# EAGLE design PKD_shield (EAGLE 6.1)
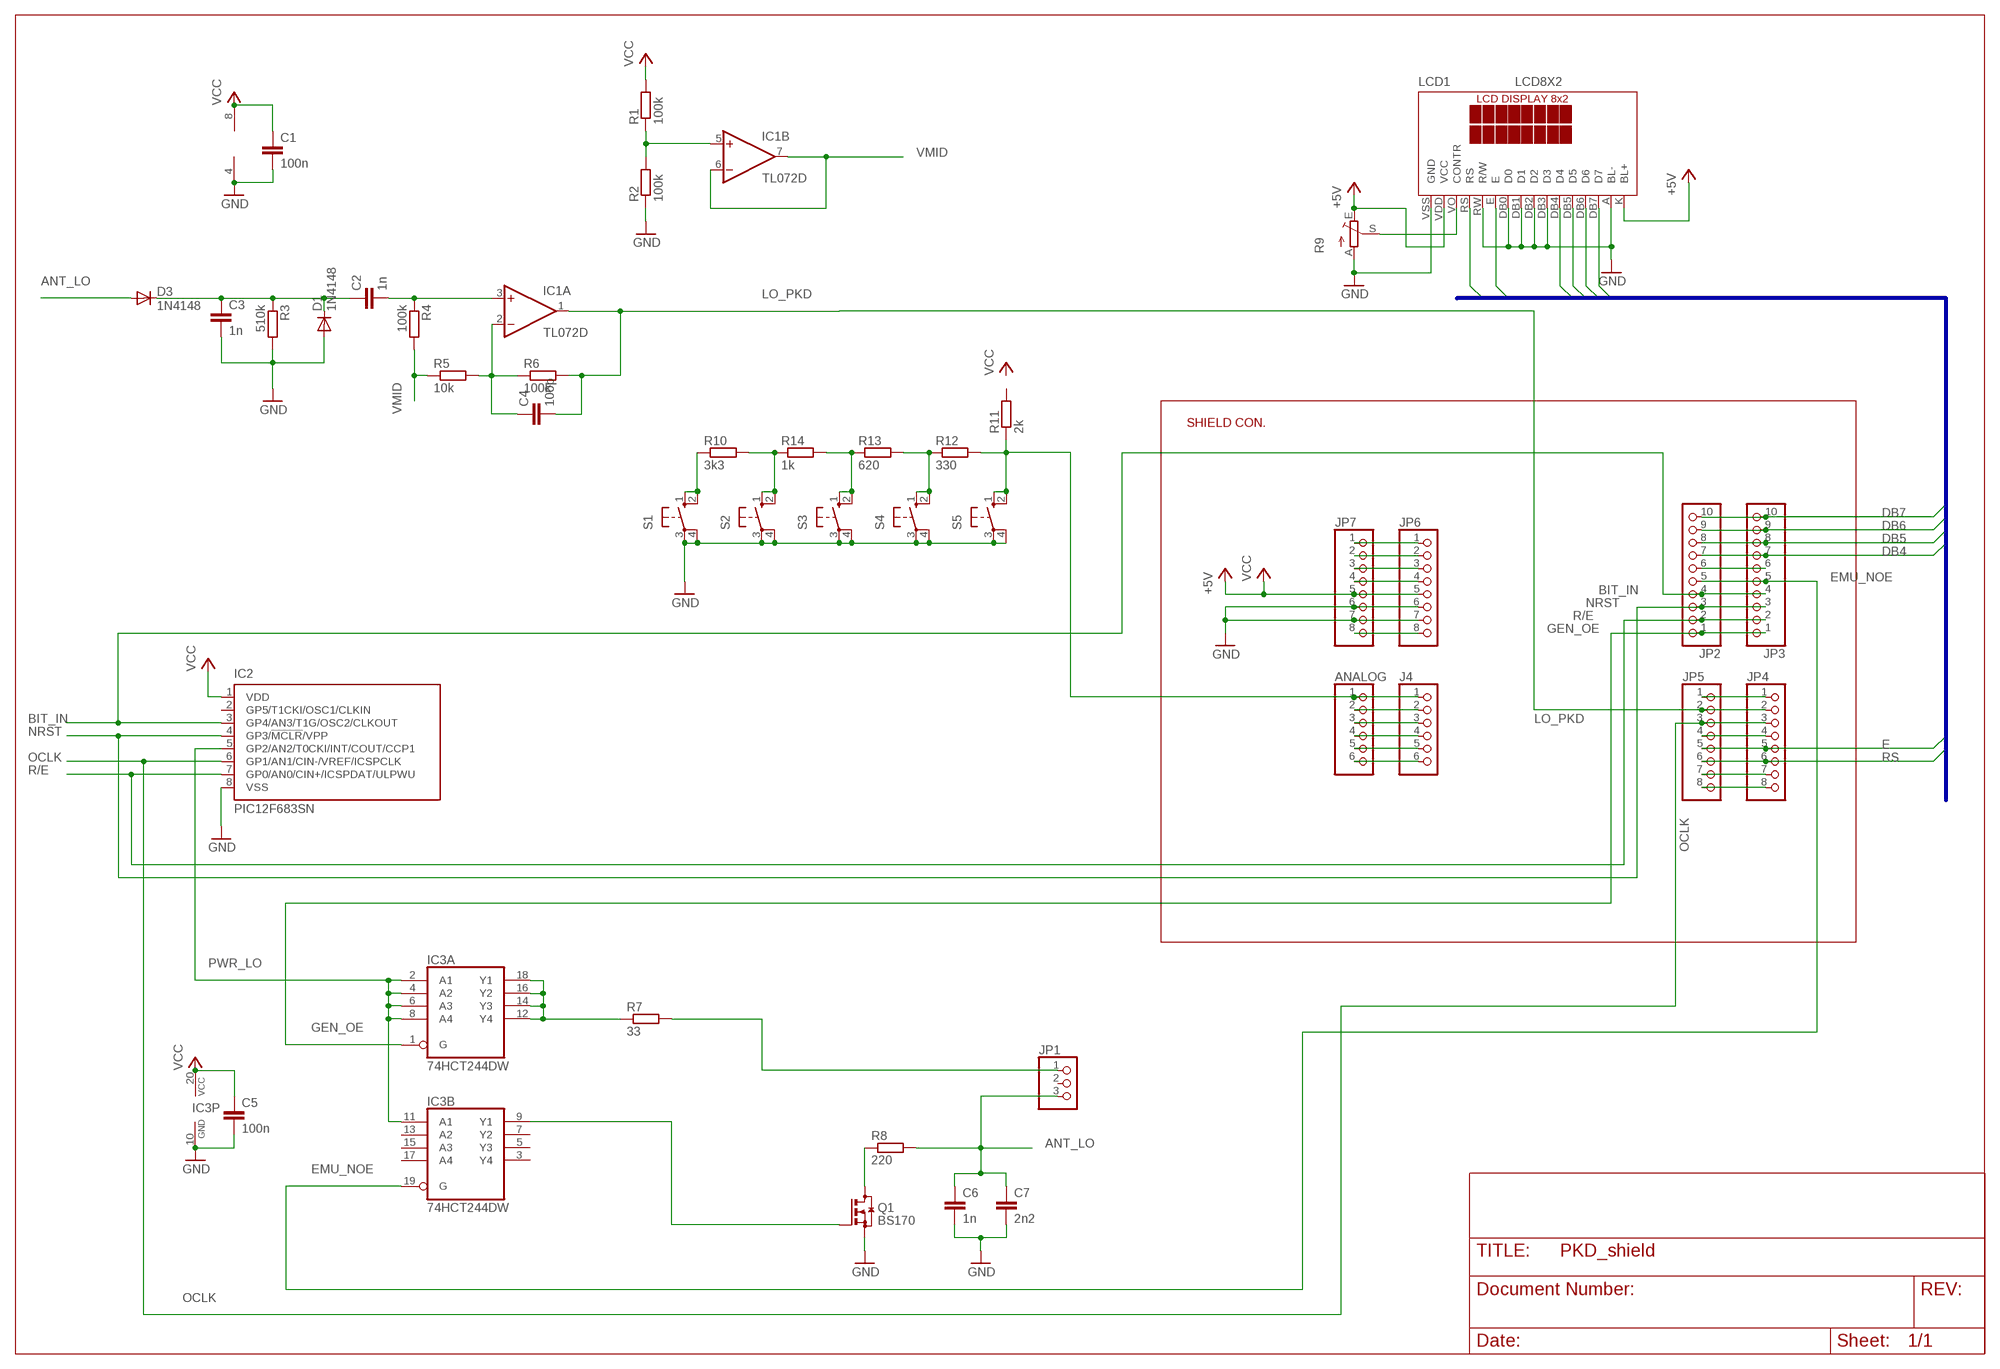
[diagram p0: schematic, sheet 1]

## Parts
ANALOG  PINHD-1X6  [1X06]
C1  100n  C-EUC1206  [C1206]
C2  1n  C-EUC1206  [C1206]
C3  1n  C-EUC1206  [C1206]
C4  100p  C-EUC1206  [C1206]
C5  100n  C-EUC1206  [C1206]
C6  1n  C-EUC1206  [C1206]
C7  2n2  C-EUC1206  [C1206]
D1  1N4148  DIODE-MELF-MLL41  [MELF-MLL41]
D3  1N4148  DIODE-MELF-MLL41  [MELF-MLL41]
IC1  TL072D  [SO08]
IC2  PIC12F683SN  [SO-08]
IC3  74HCT244DW  [SO20W]
J4  PINHD-1X6  [1X06]
JP1  PINHD-1X3  [1X03]
JP2  PINHD-1X10  [1X10]
JP3  PINHD-1X10  [1X10]
JP4  PINHD-1X8  [1X08]
JP5  PINHD-1X8  [1X08]
JP6  PINHD-1X8  [1X08]
JP7  PINHD-1X8  [1X08]
LCD1  LCD8X2  [LCD8X2]
Q1  BS170  [TO92]
R1  100k  R-EU_R1206  [R1206]
R2  100k  R-EU_R1206  [R1206]
R3  510k  R-EU_R1206  [R1206]
R4  100k  R-EU_R1206  [R1206]
R5  10k  R-EU_R1206  [R1206]
R6  100k  R-EU_R1206  [R1206]
R7  33  R-EU_R1206  [R1206]
R8  220  R-EU_R1206  [R1206]
R9  TRIM_EU-B25P  [B25P]
R10  3k3  R-EU_R1206  [R1206]
R11  2k  R-EU_R1206  [R1206]
R12  330  R-EU_R1206  [R1206]
R13  620  R-EU_R1206  [R1206]
R14  1k  R-EU_R1206  [R1206]
S1  10-XX  [B3F-10XX]
S2  10-XX  [B3F-10XX]
S3  10-XX  [B3F-10XX]
S4  10-XX  [B3F-10XX]
S5  10-XX  [B3F-10XX]

## Nets
+5V: LCD1.K(BL+) LCD1.VDD(VCC) R9.E
+9V: JP6.8 JP7.8
ANT_LO: C6.1 C7.1 D3.A JP1.3 R8.2
BIT_IN: IC2.3(GP4/AN3/T1G/OSC2/CLKOUT) JP2.4 JP3.4
DB4: JP2.7 JP3.7 LCD1.DB4(D4)
DB5: JP2.8 JP3.8 LCD1.DB5(D5)
DB6: JP2.9 JP3.9 LCD1.DB6(D6)
DB7: JP2.10 JP3.10 LCD1.DB7(D7)
E: JP4.5 JP5.5 LCD1.E
EMU_NOE: IC3.19(B:G) JP2.5 JP3.5
GEN_OE: IC3.1(A:G) JP2.1 JP3.1
GND: C1.2 C3.2 C5.2 C6.2 C7.2 D1.A IC1.4(P:V-) IC2.8(VSS) IC3.10(P:GND) JP6.7 JP7.7 LCD1.A(BL-) LCD1.DB0(D0) LCD1.DB1(D1) LCD1.DB2(D2) LCD1.DB3(D3) LCD1.RW(R/W) LCD1.VSS(GND) Q1.3(S) R2.1 R3.2 R9.A S1.3(P) S1.4(P1) S2.3(P) S2.4(P1) S3.3(P) S3.4(P1) S4.3(P) S4.4(P1) S5.3(P) S5.4(P1)
LO_PKD: JP4.2 JP5.2
LO_PKD_U: C4.2 IC1.1(A:OUT) R6.2
N$1: JP6.3 JP7.3
N$2: LCD1.VO(CONTR) R9.S
N$3: JP2.6 JP3.6
N$5: IC3.9(B:Y1) Q1.2(G)
N$6: R10.1 S1.1(S) S1.2(S1)
N$7: R10.2 R14.1 S2.1(S) S2.2(S1)
N$8: JP4.1 JP5.1
N$9: R13.1 R14.2 S3.1(S) S3.2(S1)
N$10: R12.1 R13.2 S4.1(S) S4.2(S1)
N$11: JP4.4 JP5.4
N$14: JP4.7 JP5.7
N$15: JP4.8 JP5.8
N$16: IC1.5(B:+IN) R1.1 R2.2
N$17: C2.1 C3.1 D1.C D3.C R3.1
N$18: ANALOG.1 J4.1 R11.1 R12.2 S5.1(S) S5.2(S1)
N$19: ANALOG.2 J4.2
N$20: ANALOG.3 J4.3
N$21: ANALOG.4 J4.4
N$22: ANALOG.5 J4.5
N$23: ANALOG.6 J4.6
N$25: JP6.6 JP7.6
N$26: C2.2 IC1.3(A:+IN) R4.1
N$27: C4.1 IC1.2(A:-IN) R5.2 R6.1
N$29: JP1.1 R7.2
N$30: IC3.12(A:Y4) IC3.14(A:Y3) IC3.16(A:Y2) IC3.18(A:Y1) R7.1
N$31: JP6.2 JP7.2
N$32: JP6.1 JP7.1
N$34: Q1.1(D) R8.1
N$223: JP6.4 JP7.4
NRST: IC2.4(GP3/!MCLR!/VPP) JP2.3 JP3.3
OCLK: IC2.6(GP1/AN1/CIN-/VREF/ICSPCLK) JP4.3 JP5.3
PWR_LO: IC2.5(GP2/AN2/T0CKI/INT/COUT/CCP1) IC3.2(A:A1) IC3.4(A:A2) IC3.6(A:A3) IC3.8(A:A4) IC3.11(B:A1)
R/E: IC2.7(GP0/AN0/CIN+/ICSPDAT/ULPWU) JP2.2 JP3.2
RS: JP4.6 JP5.6 LCD1.RS
VCC: C1.1 C5.1 IC1.8(P:V+) IC2.1(VDD) IC3.20(P:VCC) JP6.5 JP7.5 R1.2 ; supply symbol labelled +5V
VMID: IC1.6(B:-IN) IC1.7(B:OUT) R4.2 R5.1
Unconnected: IC2.2(GP5/T1CKI/OSC1/CLKIN) IC3.3(B:Y4) IC3.5(B:Y3) IC3.7(B:Y2) IC3.13(B:A2) IC3.15(B:A3) IC3.17(B:A4) JP1.2 R11.2

## Buses
RS,E,DB[4..7]

## Notes on the sheet
- SHIELD CON.

## Library data of the parts
ANALOG J4 = pinhead:PINHD-1X6: PIN HEADER
C1-C7 = rcl:C-EU: CAPACITOR, European symbol
D1 D3 = diode:DIODE-: DIODE
IC1 = linear:TL072: OP AMP
IC2 = microchip:PIC12F683: 8-Pin Flash-Based, 8-Bit CMOS Microcontrollers with nanoWatt Technology Source: http://ww1.microchip.com/downloads/en/DeviceDoc/41211D_.pdf; MF: MICROCHIP; MPN: PIC12F683-I/SN; OC_FARNELL: 9759042; OC_NEWARK: 61K3434
IC3 = 74xx-eu:74*244: Octal BUFFER and LINE DRIVER, 3-state
JP1 = pinhead:PINHD-1X3: PIN HEADER
JP2 JP3 = pinhead:PINHD-1X10: PIN HEADER
JP4-JP7 = pinhead:PINHD-1X8: PIN HEADER
LCD1 = various:LCD8X2
Q1 = various:BS170
R1-R8 R10-R14 = rcl:R-EU_: RESISTOR, European symbol
R9 = pot:TRIM_EU-: POTENTIOMETER
S1-S5 = switch-omron:10-XX: OMRON SWITCH; MPN: B3F-1000; OC_FARNELL: 176432; OC_NEWARK: 36M3542

## Net classes
0 default: width 0.4 mm, clearance 0.4 mm

## Board
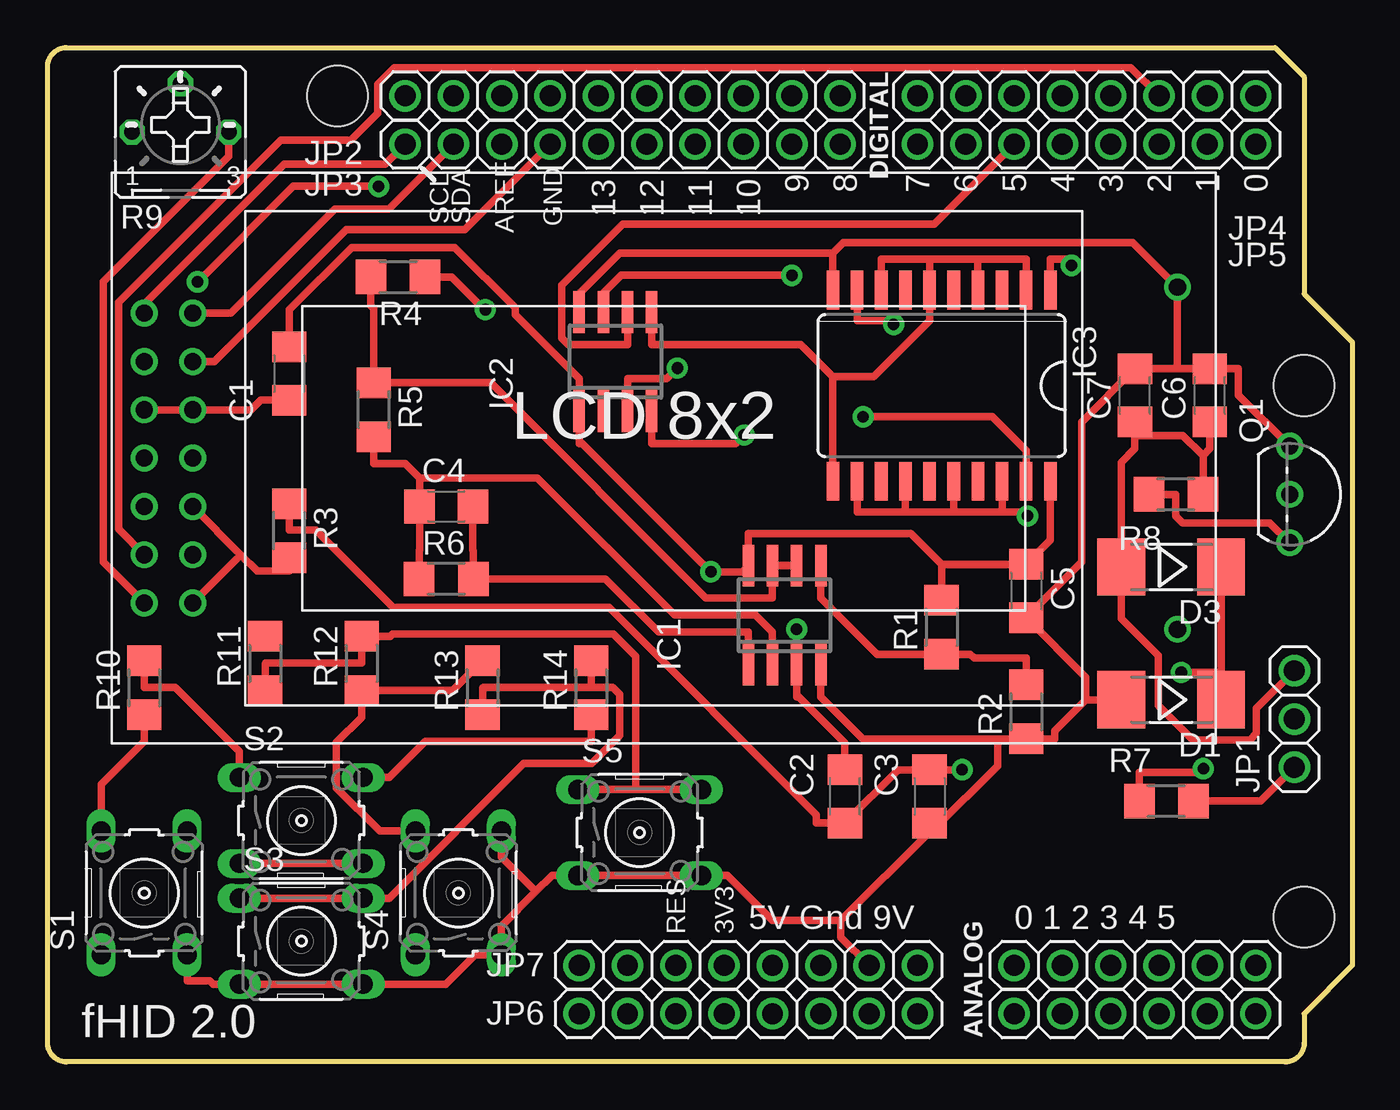
[diagram p1: board, top side]
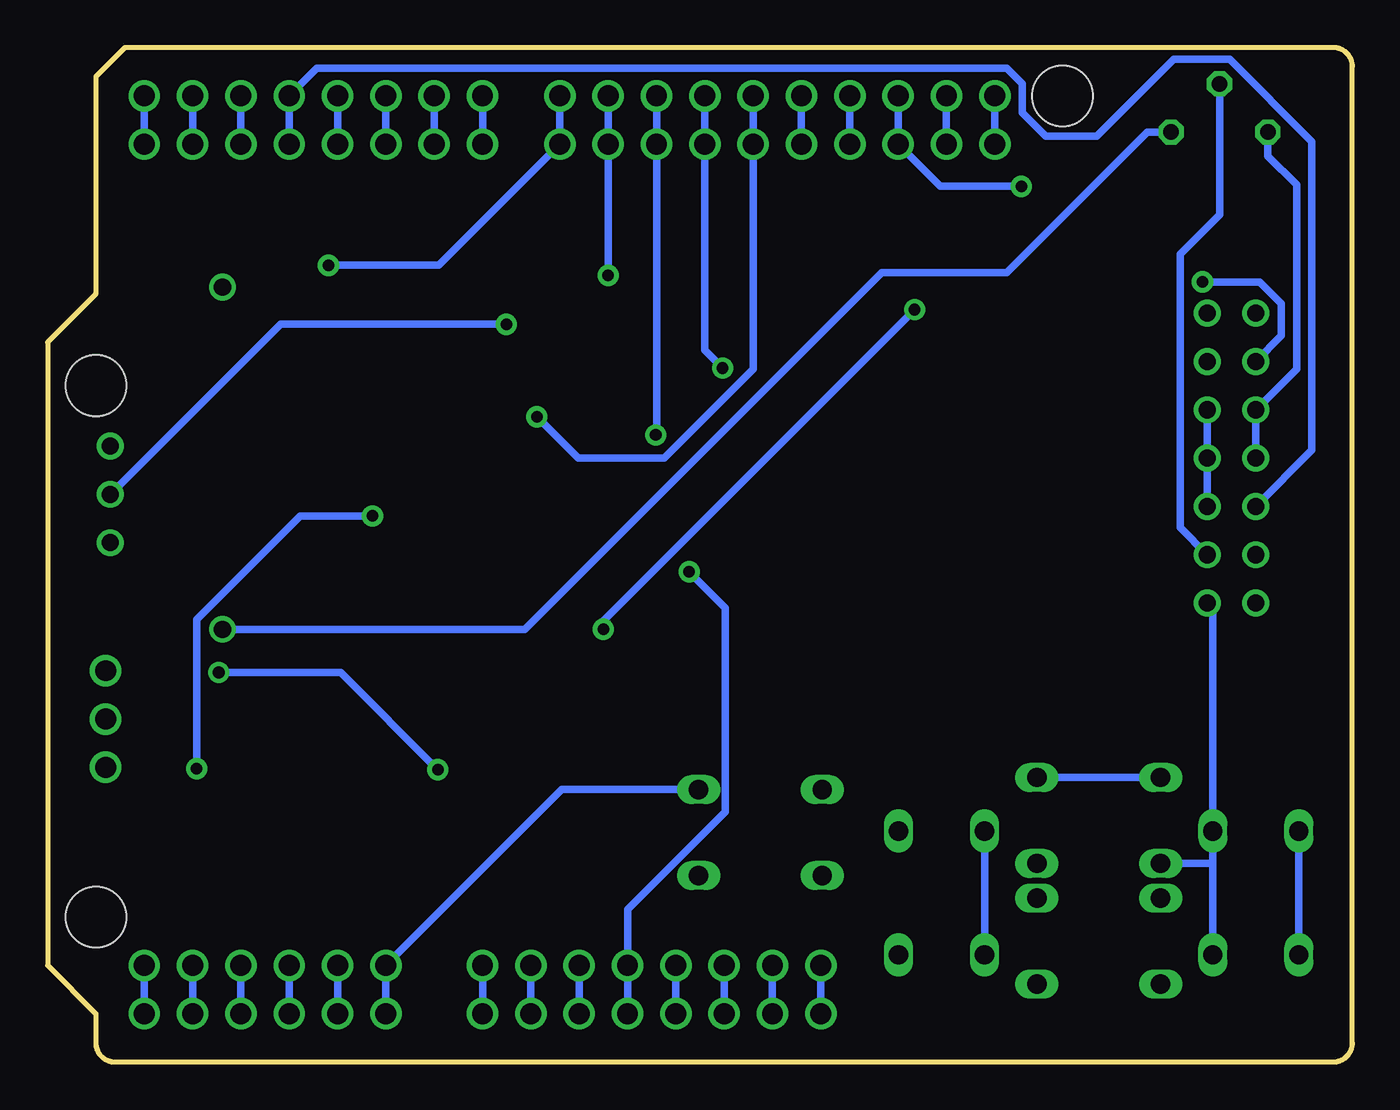
[diagram p2: board, bottom side, seen from below]

Size 68.58 x 53.34 mm. Coordinates in mm from the lower left corner, seen from the top.
Outline: 64.52,53.34 66.04,51.82 66.04,40.39 68.58,37.85 68.58,5.08 66.04,2.54 66.04,1 arc-90 65.04,0 1,0 arc-90 0,1 0,52.34 arc-90 1,53.34 64.52,53.34
Copper layers (1*16): Top 0.035mm / dielectric 1.5mm / Bottom 0.035mm
Design rules: minimum track width 10mil, minimum drill 24mil, track to track 10mil, track to pad 0.4032mm, pad to pad 10mil, via to via 10mil, smd to smd 8mil, copper to edge 40mil, drill to drill 10mil, minimum pad ring 10mil, minimum via ring 0.2532mm, stop-mask expansion 2mil, vias tented up to drill 0mil, thermal gap 10mil
Holes 3.2 mm at 15.24,50.8 66.04,7.62 66.04,35.56

### Footprints (pad centres in the part's own frame; a part is rotated, then mirrored left to right if it is on the bottom)
1X06 = drill 1.1: 1 -6.35,0; 2 -3.81,0; 3 -1.27,0; 4 1.27,0; 5 3.81,0; 6 6.35,0
C1206 = smd 1.6 x 1.8: 1 -1.4,0; 2 1.4,0
MELF-MLL41 = smd 2.5 x 3: A 2.625,0; C -2.625,0
SO08 = smd 0.6 x 2.2: 1 -1.905,-2.6; 2 -0.635,-2.6; 3 0.635,-2.6; 4 1.905,-2.6; 5 1.905,2.6; 6 0.635,2.6; 7 -0.635,2.6; 8 -1.905,2.6
SO-08 = smd 0.6 x 2.2: 1 -1.905,-2.6; 2 -0.635,-2.6; 3 0.635,-2.6; 4 1.905,-2.6; 5 1.905,2.6; 6 0.635,2.6; 7 -0.635,2.6; 8 -1.905,2.6
SO20W = smd 0.66 x 2.032: 1 -5.715,-5.029; 2 -4.445,-5.029; 3 -3.175,-5.029; 4 -1.905,-5.029; 5 -0.635,-5.029; 6 0.635,-5.029; 7 1.905,-5.029; 8 3.175,-5.029; 9 4.445,-5.029; 10 5.715,-5.029; 11 5.715,5.029; 12 4.445,5.029; 13 3.175,5.029; 14 1.905,5.029; 15 0.635,5.029; 16 -0.635,5.029; 17 -1.905,5.029; 18 -3.175,5.029; 19 -4.445,5.029; 20 -5.715,5.029
1X03 = drill 1.1: 1 -2.54,0; 2 0,0; 3 2.54,0
1X10 = drill 1.1: 1 -11.43,0; 2 -8.89,0; 3 -6.35,0; 4 -3.81,0; 5 -1.27,0; 6 1.27,0; 7 3.81,0; 8 6.35,0; 9 8.89,0; 10 11.43,0
1X08 = drill 1.1: 1 -8.89,0; 2 -6.35,0; 3 -3.81,0; 4 -1.27,0; 5 1.27,0; 6 3.81,0; 7 6.35,0; 8 8.89,0
LCD8X2 = drill 0.9: A 56.005,24.02; DB0 4.245,15.02; DB1 1.705,15.02; DB2 4.245,17.56; DB3 1.705,17.56; DB4 4.245,20.1; DB5 1.705,20.1; DB6 4.245,22.64; DB7 1.705,22.64; E 1.705,12.48; K 56.005,6.02; RS 1.705,9.94; RW 4.245,12.48; VDD 1.705,7.4; VO 4.245,9.94; VSS 4.245,7.4
TO92 = drill 0.9: 1 2.54,0; 2 0,0; 3 -2.54,0
R1206 = smd 1.6 x 1.803: 1 -1.422,0; 2 1.422,0
B25P = drill 0.813 octagon: A -2.54,0; E 2.54,0; S 0,2.54
B3F-10XX = drill 1.016 long: 1 -3.251,2.261; 2 3.251,2.261; 3 -3.251,-2.261; 4 3.251,-2.261

### Placement (x,y rotation side)
ANALOG  57.15,2.54 0 top
C1  12.7,36.2 270 top
C2  41.91,13.97 90 top
C3  46.35,13.97 270 top
C4  20.95,29.21 0 top
C5  51.44,24.77 270 top
C6  61.09,35.05 90 top
C7  57.15,35.05 90 top
D1  59.05,19.05 180 top
D3  59.05,26.04 180 top
IC1  38.73,23.5 0 top
IC2  29.84,36.83 0 top
IC3  46.99,35.56 180 top
J4  57.15,5.08 0 top
JP1  65.53,18.03 90 top
JP2  30.23,50.8 180 top
JP3  30.23,48.26 180 top
JP4  54.61,50.8 0 top
JP5  54.61,48.26 0 top
JP6  36.83,2.54 0 top
JP7  36.83,5.08 0 top
LCD1  3.38,16.73 0 top
Q1  65.28,29.84 270 top
R1  46.99,22.86 90 top
R2  51.44,18.41 90 top
R3  12.7,27.94 270 top
R4  18.41,41.27 180 top
R5  17.14,34.29 270 top
R6  20.95,25.4 0 top
R7  58.8,13.72 0 top
R8  59.31,29.84 0 top
R9  6.99,48.9 0 top
R10  5.08,19.68 90 top
R11  11.43,20.95 90 top
R12  16.51,20.95 90 top
R13  22.86,19.68 90 top
R14  28.57,19.68 90 top
S1  5.08,8.89 90 top
S2  13.34,12.7 0 top
S3  13.34,6.35 0 top
S4  21.59,8.89 90 top
S5  31.11,12.06 0 top

### Tracks (layer width: path | path; a pad name or v marks a point on that pad's centre or on a via)
+5V
  Top 0.4: R9.E 9.53,47.63 2.94,41.04 2.94,26.28 LCD1.VDD
  Bottom 0.4: R9.E 10.79,48.9 18.18,41.51 24.74,41.51 43.49,22.75 LCD1.K
+9V
  Bottom 0.4: JP7.8 JP6.8
ANT_LO
  Top 0.4: 60.73,31.89 61.09,32.25 C6.1 | R8.2 60.73,31.89 | 57.15,32.95 59.67,32.95 60.73,31.89 | 57.15,32.95 57.15,32.25 56.43,31.53 D3.A 56.43,23.31 58.37,21.37 58.37,18.75 60.18,16.95 63.21,16.95 63.53,17.28 63.53,18.58 JP1.3 | C7.1 57.15,32.95
BIT_IN  (via drill 0.61 pad 1.12)
  Top 0.4: v33.1,36.48 32.55,35.93 30.48,35.93 IC2.3
  Bottom 0.4: v33.1,36.48 34.04,37.42 JP3.4 JP2.4
DB4
  Top 0.4: LCD1.DB4 8.76,36.83 15.69,43.76 21.92,43.76 JP3.7
  Bottom 0.4: JP3.7 JP2.7
DB5  (via drill 0.61 pad 1.12)
  Top 0.4: v7.88,41.01 12.91,46.04 v17.4,46.04
  Bottom 0.4: LCD1.DB5 3.73,38.18 3.73,39.88 4.87,41.01 v7.88,41.01 | v17.4,46.04 21.66,46.04 JP3.8 JP2.8
DB6
  Top 0.4: LCD1.DB6 9.62,39.37 15.1,44.84 17.92,44.84 JP3.9
  Bottom 0.4: JP3.9 JP2.9
DB7
  Top 0.4: JP3.10 17.75,47.22 12.44,47.22 5.08,39.86 LCD1.DB7
  Bottom 0.4: JP3.10 JP2.10
E
  Bottom 0.4: LCD1.E 2.13,32.16 2.13,48.4 6.46,52.72 9.38,52.72 13.43,48.68 16.13,48.68 17.36,49.91 17.36,51.43 18.18,52.25 54.43,52.25 JP4.5 JP5.5
EMU_NOE  (via drill 0.61 pad 1.12)
  Top 0.4: IC3.19 51.44,32.15 49.66,33.93 v42.86,33.93
  Bottom 0.4: v42.86,33.93 40.69,31.76 36.18,31.76 31.5,36.44 JP3.5 JP2.5
GEN_OE  (via drill 0.61 pad 1.12)
  Top 0.4: v53.82,41.89 53.5,42.21 52.7,42.21 IC3.1
  Bottom 0.4: v53.82,41.89 48.03,41.89 JP3.1 JP2.1
GND
  Top 0.4: 59.38,36.45 59.58,36.45 C6.2 62.59,36.45 62.59,35.07 Q1.3 | 59.38,36.45 C7.2 54.35,33.65 54.35,26.28 C5.2 54.58,20.22 54.58,19.05 | 59.38,36.45 LCD1.A 57.05,43.09 41.83,43.09 41.27,42.54 | LCD1.DB3 LCD1.DB2 10.69,34.29 11.2,34.8 C1.2 | 49.93,16.99 42.84,16.99 40.64,19.19 IC1.4 | 46.35,12.22 46.57,12.22 49.93,15.58 49.93,16.99 | 49.93,16.99 R2.1 52.94,16.99 52.94,17.41 54.58,19.05 | 46.35,12.22 46.35,12.11 41.7,7.45 | 41.7,7.45 38.08,7.45 35.73,9.8 S5.4 S5.3 26.7,9.8 26.51,9.8 25.67,8.96 | 41.7,7.45 41.7,6.56 JP7.7 | 25.67,8.96 23.85,7.14 S4.3 22.48,5.64 20.94,4.09 S3.4 S3.3 8.72,4.09 8.53,4.27 7.34,4.27 S1.3 | 25.67,8.96 23.85,10.78 S4.4 | D1.A 54.58,19.05 | 41.27,42.54 41.27,42.21 IC3.10 | 41.27,42.54 30.06,42.54 27.94,40.41 IC2.8 | 10.16,26.67 LCD1.RW | 10.16,26.67 11.02,25.82 12.7,25.82 R3.2 | LCD1.VSS 10.16,26.67 | C3.2 46.35,12.22 | S2.4 S2.3
  Bottom 0.4: JP7.7 JP6.7 | 7.34,10.44 S1.4 7.34,23.85 LCD1.VSS | S1.3 7.34,10.44 | 7.34,10.44 8.72,10.44 S2.3 | LCD1.DB2 LCD1.DB0 LCD1.RW | LCD1.DB1 LCD1.DB3 2.93,36.44 2.93,46.12 4.45,47.63 R9.A
LO_PKD
  Bottom 0.4: JP5.2 JP4.2
LO_PKD_U
  Top 0.4: IC1.1 36.83,22.6 32.12,22.6 29.32,25.4 R6.2 22.38,26.91 22.36,26.93 C4.2
N$1
  Bottom 0.4: JP7.3 JP6.3
N$2
  Bottom 0.4: R9.S 6.99,44.54 9.05,42.48 9.05,28.1 LCD1.VO
N$3
  Bottom 0.4: JP3.6 JP2.6
N$5  (via drill 0.61 pad 1.12)
  Top 0.4: IC3.9 42.55,38.97 44.29,38.97 v44.47,38.79
  Bottom 0.4: Q1.2 56.33,38.79 v44.47,38.79
N$6
  Top 0.4: R10.1 5.08,16.86 2.82,14.6 S1.2
  Bottom 0.4: S1.2 S1.1
N$7
  Top 0.4: S2.2 17.95,14.96 19.85,16.86 28.57,16.86 R14.1 | R10.2 5.08,19.7 6.71,19.7 10.08,16.33 S2.1
  Bottom 0.4: S2.2 S2.1
N$8
  Bottom 0.4: JP5.1 JP4.1
N$9
  Top 0.4: 28.57,19.7 29.69,19.7 30.08,19.32 30.08,17.17 28.6,15.69 25.03,15.69 17.95,8.61 S3.2 S3.1 | R14.2 28.57,19.7 | R13.1 22.86,19.67 22.9,19.7 28.57,19.7
N$10
  Top 0.4: S4.2 17.45,12.14 15.18,14.4 15.18,16.8 16.51,18.13 R12.1 21.29,19.53 R13.2
  Bottom 0.4: S4.2 S4.1
N$11
  Bottom 0.4: JP5.4 JP4.4
N$14
  Bottom 0.4: JP5.7 JP4.7
N$15
  Bottom 0.4: JP5.8 JP4.8
N$16
  Top 0.4: IC1.5 40.64,24.39 43.59,21.44 R1.1 47.74,21.44 48.49,21.44 48.69,21.24 51.44,21.24 R2.2
N$17  (via drill 0.61 pad 1.12)
  Top 0.4: R3.1 12.7,27.96 14.1,27.96 18.17,23.89 29.52,23.89 40.41,13.01 40.41,12.57 C2.1 44.71,15.37 C3.1 47.86,15.37 v48.07,15.37 | 61.68,20.48 D1.C | D3.C 61.68,20.48 | 61.68,20.48 v59.58,20.48
  Bottom 0.4: v59.58,20.48 53.18,20.48 v48.07,15.37
N$18
  Top 0.4: R11.1 11.43,20.94 11.47,20.97 16.51,20.97 R12.2 17.26,22.38 18.02,22.38 18.15,22.51 29.73,22.51 30.91,21.33 30.91,14.33 | 30.91,14.33 S5.1 | S5.2 30.91,14.33
  Bottom 0.4: S5.2 41.55,14.33 J4.1 ANALOG.1
N$19
  Bottom 0.4: J4.2 ANALOG.2
N$20
  Bottom 0.4: J4.3 ANALOG.3
N$21
  Bottom 0.4: J4.4 ANALOG.4
N$22
  Bottom 0.4: J4.5 ANALOG.5
N$23
  Bottom 0.4: J4.6 ANALOG.6
N$25
  Bottom 0.4: JP7.6 JP6.6
N$26  (via drill 0.61 pad 1.12)
  Top 0.4: v39.37,22.76 IC1.3 39.37,19.19 39.49,19.19 41.91,16.77 C2.2 | v23.01,39.56 22.96,39.56 21.24,41.27 R4.1
  Bottom 0.4: v23.01,39.56 39.37,23.2 v39.37,22.76
N$27
  Top 0.4: 19.55,30.71 25.74,30.71 32.96,23.5 37.2,23.5 38.1,22.6 IC1.2 | 19.55,30.71 18.8,31.46 17.14,31.46 R5.2 | 19.55,30.71 C4.1 19.55,26.93 19.53,26.91 R6.1
N$29
  Top 0.4: R7.2 63.75,13.72 JP1.1
N$30  (via drill 0.61 pad 1.12)
  Top 0.4: IC3.12 42.55,28.91 45.09,28.91 | 45.09,28.91 45.09,29.11 IC3.14 | 47.62,28.91 45.09,28.91 | 47.62,28.91 47.62,29.11 IC3.16 | 50.16,28.91 47.62,28.91 | v51.5,28.71 51.3,28.91 50.16,28.91 | v60.74,15.42 60.54,15.22 57.38,15.22 R7.1 | IC3.18 50.16,28.91
  Bottom 0.4: v51.5,28.71 55.31,28.71 60.74,23.28 v60.74,15.42
N$31
  Bottom 0.4: JP7.2 JP6.2
N$32
  Bottom 0.4: JP7.1 JP6.1
N$34
  Top 0.4: R8.1 59.29,29.84 59.29,28.7 59.66,28.34 64.24,28.34 Q1.1
N$223
  Bottom 0.4: JP7.4 JP6.4
NRST  (via drill 0.61 pad 1.12)
  Top 0.4: v36.61,32.97 36.17,32.53 31.75,32.53 IC2.4
  Bottom 0.4: v36.61,32.97 36.58,33.01 JP3.3 JP2.3
OCLK
  Top 0.4: IC2.6 30.48,37.73 27.37,37.73 27.03,38.06 27.03,40.85 30.23,44.06 46.6,44.06 JP5.3
  Bottom 0.4: JP5.3 JP4.3
PWR_LO
  Top 0.4: 41.27,36.03 43.42,36.03 46.35,38.97 IC3.6 46.35,41.4 46.35,42.21 | 41.27,36.03 39.58,37.73 31.75,37.73 IC2.5 | 41.27,36.03 41.27,32.15 IC3.11 | IC3.2 51.44,42.21 48.9,42.21 | 48.9,42.21 48.9,42.01 IC3.4 | IC3.8 43.81,42.21 46.35,42.21 | 48.9,42.21 46.35,42.21
R/E  (via drill 0.61 pad 1.12)
  Top 0.4: IC2.7 29.21,40.42 30.16,41.37 v39.12,41.37
  Bottom 0.4: v39.12,41.37 JP3.2 JP2.2
RS
  Top 0.4: LCD1.RS 3.74,28.02 3.74,39.95 12.26,48.47 15.95,48.47 17.36,49.88 17.36,51.42 18.21,52.28 56.94,52.28 JP4.6
  Bottom 0.4: JP5.6 JP4.6
VCC  (via drill 0.61 pad 1.12)
  Top 0.4: 46.99,26.16 45.36,27.8 36.83,27.8 IC1.8 36.51,25.78 v34.86,25.78 28.11,32.53 27.94,32.53 IC2.1 27.94,35.93 24.57,39.3 24.57,39.67 21.41,42.83 15.98,42.83 12.7,39.55 12.7,39 C1.1 | 46.99,26.16 49.93,26.16 C5.1 52.7,27.43 IC3.20 | 46.99,26.16 46.99,25.68 R1.2
  Bottom 0.4: v34.86,25.78 32.97,23.89 32.97,13.14 38.1,8.01 JP7.5 JP6.5
VMID
  Top 0.4: R4.2 16.99,39.77 17.14,39.62 R5.1 23.28,35.71 34.6,24.39 38.1,24.39 IC1.7 IC1.6

### Text on the board
tPlace: 9 | 8 | 7 | 6 | 5 | 4 | 3 | 2 | 1 | 0 | 13 | 12 | 11 | 10 | fHID 2.0
tNames: DIGITAL | AREF | SCL | SDA | GND | RES | 3V3 | 5V Gnd 9V | 0 1 2 3 4 5
bStop: DIGITAL | SDA | AREF | SCL | GND | 13 | 12 | 11 | 9 | 8 | 7 | 6 | 5 | 4 | 3 | 2 | 1 | 0 | 10 | IOREF | RST | 3.3V | 5V | GND | GND | VIN | ANALOG | 0 | 1 | 2 | 3 | 4 | 5
Reference: USB | ETH